# EAGLE design Speaker (EAGLE 7.7.0)
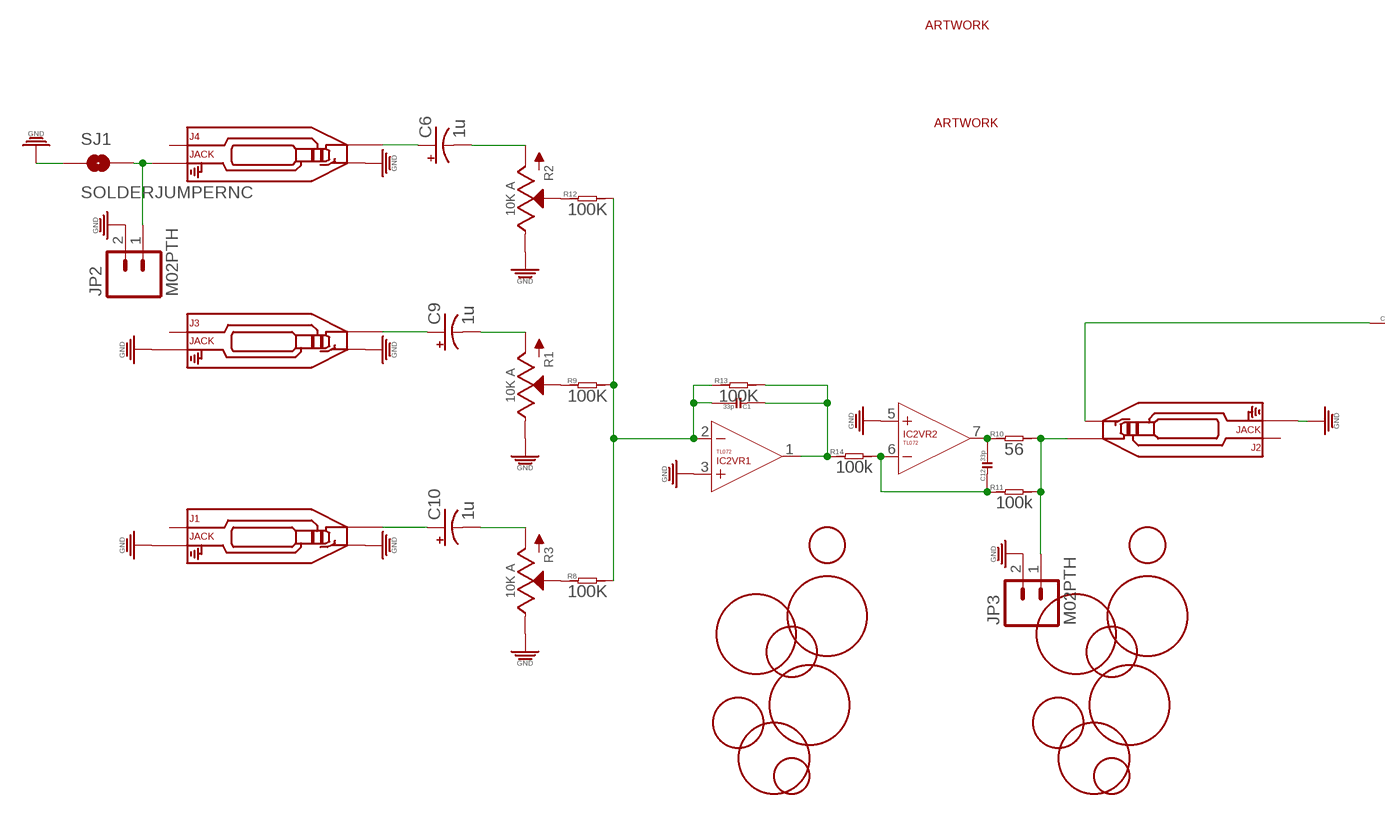
[diagram p0: schematic, sheet 1, part 1 of 2]
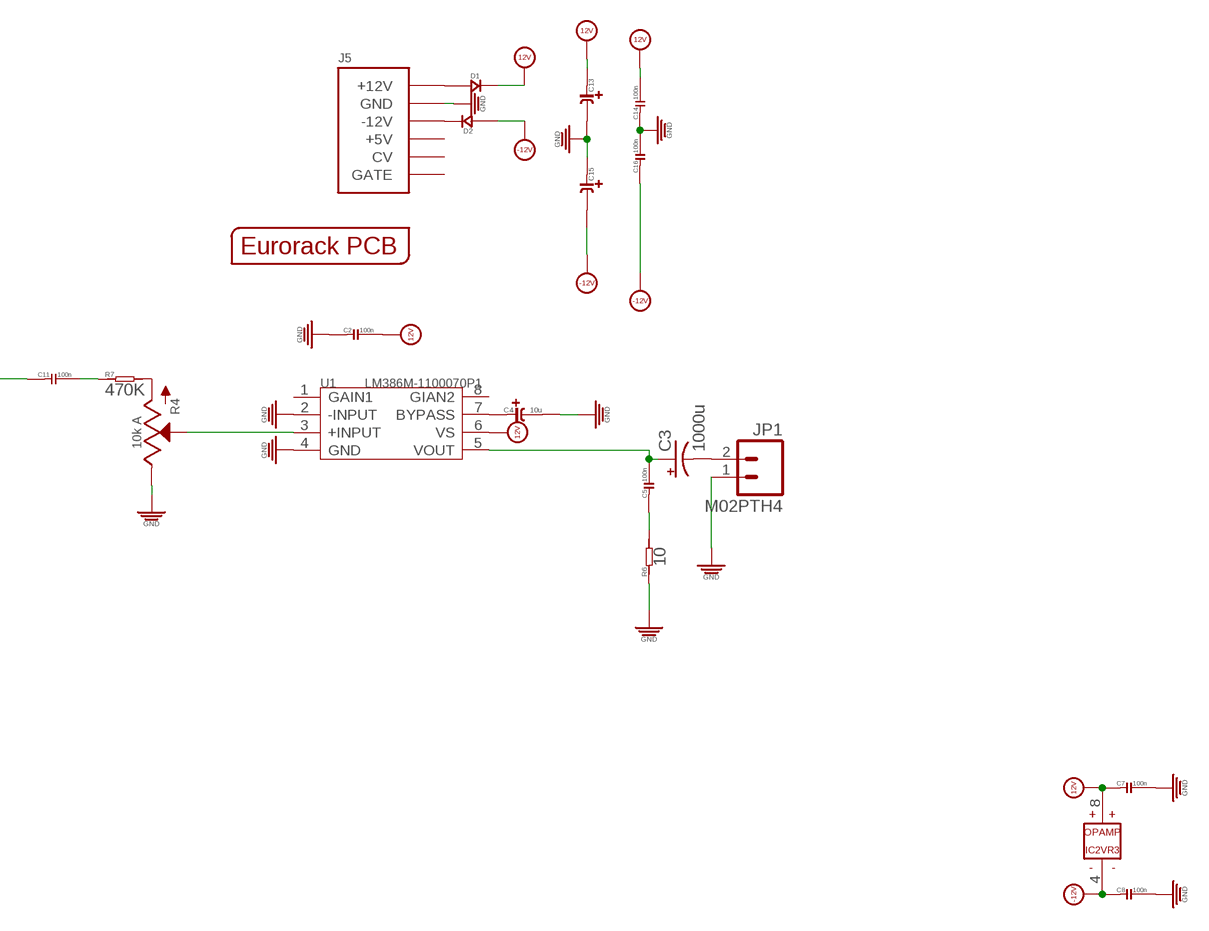
[diagram p1: schematic, sheet 1, part 2 of 2]

## Parts
C1  33p  C-0603  [C0603]
C2  100n  C-0603  [C0603]
C3  1000u  CPOL-US153CLV-1010  [153CLV-1010]
C4  10u  C-POLAR-A  [CASE-A_3216]
C5  100n  C-0603  [C0603]
C6  1u  CPOL-USD  [PANASONIC_D]
C7  100n  C-0603  [C0603]
C8  100n  C-0603  [C0603]
C9  1u  CPOL-USD  [PANASONIC_D]
C10  1u  CPOL-USD  [PANASONIC_D]
C11  100n  C-0603  [C0603]
C12  33p  C-0603  [C0603]
C13  C-POLAR-A  [CASE-A_3216]
C14  100n  C-0603  [C0603]
C15  C-POLAR-A  [CASE-A_3216]
C16  100n  C-0603  [C0603]
D1  D-SOD-123  [SOD123]
D2  D-SOD-123  [SOD123]
IC2  TL072  [SO08]
J1  JACK  AUDIO-JACK_SMALLSYMBOLNODRILL  [3.5MM-JACK-SWITCH-13MM-NOHOLES]
J2  JACK  AUDIO-JACK_SMALLSYMBOLNODRILL  [3.5MM-JACK-SWITCH-13MM-NOHOLES]
J3  JACK  AUDIO-JACK_SMALLSYMBOLNODRILL  [3.5MM-JACK-SWITCH-13MM-NOHOLES]
J4  JACK  AUDIO-JACK_SMALLSYMBOLNODRILL  [3.5MM-JACK-SWITCH-13MM-NOHOLES]
J5  POWERSHROUDED  [POWER_16_SHROUDED]
JP1  M02PTH4  [1X02_XTRA_BIG]
JP2  M02PTH  [1X02]
JP3  M02PTH  [1X02]
PCB1  EURORACK_PCB6HP  [EURORACK6HPPCB]
R1  10K A  POTSQUAREHOLE_SMALLKNOB  [ALPS_POT_SQUAREHOLES]
R2  10K A  POTSQUAREHOLE_SMALLKNOB  [ALPS_POT_SQUAREHOLES]
R3  10K A  POTSQUAREHOLE_SMALLKNOB  [ALPS_POT_SQUAREHOLES]
R4  10k A  POTSQUAREHOLE_SMALLKNOB  [ALPS_POT_SQUAREHOLES]
R6  10  R-0603  [R0603]
R7  470K  R-0603  [R0603]
R8  100K  R-0603  [R0603]
R9  100K  R-0603  [R0603]
R10  56  R-0603  [R0603]
R11  100k  R-0603  [R0603]
R12  100K  R-0603  [R0603]
R13  100K  R-0603  [R0603]
R14  100k  R-0603  [R0603]
SJ1  SOLDERJUMPERNC  [SJ_2S]
U1  LM386M-1100070P1  [SOIC8]
U$1  BUBBLESDSA_1U  [BUBBLES]
U$8  BUBBLESINV  [BUBBLES_INV]
U$13  TINRS_ARTWORKTINYDATE  [JUSTATINYROCKET_DATECODE]
U$14  TINRS_ARTWORKLOGO  [TINRSLOGO]

## Nets
12V [power]: C2.2 C7.1 C13.+ C14.2 D1.- IC2.8(VR3:V+) U1.6(VS)
-12V [power]: C8.1 C15.- C16.1 D2.+ IC2.4(VR3:V-)
GND [power]: C2.1 C4.- C7.2 C8.2 C13.- C14.1 C15.+ C16.2 IC2.3(VR1:+IN) IC2.5(VR2:+IN) J1.RING_B@1(RING) J1.RING_T@3(RING) J1.SWITCH_B@1(SWITCH) J1.SWITCH_T@3(SWITCH) J2.RING_B@1(RING) J2.RING_T@3(RING) J3.RING_B@1(RING) J3.RING_T@3(RING) J3.SWITCH_B@1(SWITCH) J3.SWITCH_T@3(SWITCH) J4.SWITCH_B@1(SWITCH) J4.SWITCH_T@3(SWITCH) J5.3(GND) J5.4(GND) J5.5(GND) J5.6(GND) J5.7(GND) J5.8(GND) JP1.1 JP2.2 JP3.2 R1.P$1(E) R2.P$1(E) R3.P$1(E) R4.P$1(E) R6.1 SJ1.1 U1.2(-INPUT) U1.4(GND)
N$1: C3.- JP1.2
N$2 [power]: C3.+ C5.2 U1.5(VOUT)
N$3: C5.1 R6.2
N$4: C4.+ U1.7(BYPASS)
N$5: R4.P$2(S) U1.3(+INPUT)
N$6: C1.2 IC2.2(VR1:-IN) R8.2 R9.2 R12.2 R13.1
N$7: C12.1 IC2.6(VR2:-IN) R11.1 R14.2
N$8: C6.+ J4.TIP_B@1(TIP) J4.TIP_T@3(TIP)
N$9: C11.2 R7.1
N$10: C9.+ J3.TIP_B@1(TIP) J3.TIP_T@3(TIP)
N$11: C10.+ J1.TIP_B@1(TIP) J1.TIP_T@3(TIP)
N$12: C11.1 J2.SWITCH_B@1(SWITCH) J2.SWITCH_T@3(SWITCH)
N$13: C12.2 IC2.7(VR2:OUT) R10.1
N$14: J2.TIP_B@1(TIP) J2.TIP_T@3(TIP) JP3.1 R10.2 R11.2
N$15: R4.P$3(A) R7.2
N$16: R1.P$2(S) R9.1
N$17: R2.P$2(S) R12.1
N$18: R3.P$2(S) R8.1
N$19: C1.1 IC2.1(VR1:OUT) R13.2 R14.1
N$20: C10.- R3.P$3(A)
N$21: C9.- R1.P$3(A)
N$22: C6.- R2.P$3(A)
N$23 [power]: D1.+ J5.9(+12V) J5.10(+12V)
N$24 [power]: D2.- J5.1(-12V) J5.2(-12V)
N$25 [power]: J4.RING_B@1(RING) J4.RING_T@3(RING) JP2.1 SJ1.2
Unconnected: J1.SECOND_B@1(SECOND) J1.SECOND_T@3(SECOND) J2.SECOND_B@1(SECOND) J2.SECOND_T@3(SECOND) J3.SECOND_B@1(SECOND) J3.SECOND_T@3(SECOND) J4.SECOND_B@1(SECOND) J4.SECOND_T@3(SECOND) J5.11(+5V) J5.12(+5V) J5.13(CV) J5.14(CV) J5.15(GATE) J5.16(GATE) U1.1(GAIN1) U1.8(GIAN2)

## Library data of the parts
C1 C2 C5 C7 C8 C11 C12 C14 C16 = OPL:C*
C3 C6 C9 C10 = adafruit:CPOL-US: POLARIZED CAPACITOR, American symbol
C4 C13 C15 = EurorackModularParts:C-POLAR*
D1 D2 = OPL:D*: DIODE
IC2 = EurorackModularParts:TL072
J1 = EurorackModularParts:AUDIO-JACK_SMALLSYMBOL: Switching Mono 3.5mm Audio Jack from Erthenvar.; DESC: C
J2 = EurorackModularParts:AUDIO-JACK_SMALLSYMBOL: Switching Mono 3.5mm Audio Jack from Erthenvar.; DESC: Mix Out
J3 = EurorackModularParts:AUDIO-JACK_SMALLSYMBOL: Switching Mono 3.5mm Audio Jack from Erthenvar.; DESC: B
J4 = EurorackModularParts:AUDIO-JACK_SMALLSYMBOL: Switching Mono 3.5mm Audio Jack from Erthenvar.; DESC: A
J5 = EurorackModularParts:POWER
JP1-JP3 = SparkFun-Connectors:M02: Standard 2-pin 0.1" header. Use with - straight break away headers ( PRT-00116) - right angle break away headers (PRT-00553) - swiss pins (PRT-00743) - machine pins (PRT-00117) - female headers (PRT-00115) Molex polarized connector foot print use with: PRT-08233 with associated crimp pins and housings. 2.54_SCREWTERM for use with PRT-10571. 3.5mm Screw Terminal footprints for PRT-08084 5mm Screw Terminal footprints for use with PRT-08433
PCB1 = EurorackModularParts:EURORACK_PCB
R1 = EurorackModularParts:POT; DESC: B
R2 = EurorackModularParts:POT; DESC: A
R3 = EurorackModularParts:POT; DESC: C
R4 = EurorackModularParts:POT; DESC: Volume
R6-R14 = OPL:R*
SJ1 = SparkFun-Passives:SOLDERJUMPER: Solder Jumper Standard SMD solder jumper. Used to automate production. Two varients : Normally Open and Normally Closed are the same, but have different paste layers. NC will have a large amount of paste and should jumper during reflow.
U1 = OPL:LM386M: Low Voltage Audio Power Amplifier http://www.ti.com/lit/ds/symlink/lm386.pdf
U$1 U$8 = EurorackModularParts:BUBBLES
U$13 U$14 = EurorackModularParts:TINRS_ARTWORK

## Net classes
0 default: width 0.254 mm
1 power: width 0.381 mm

## Board
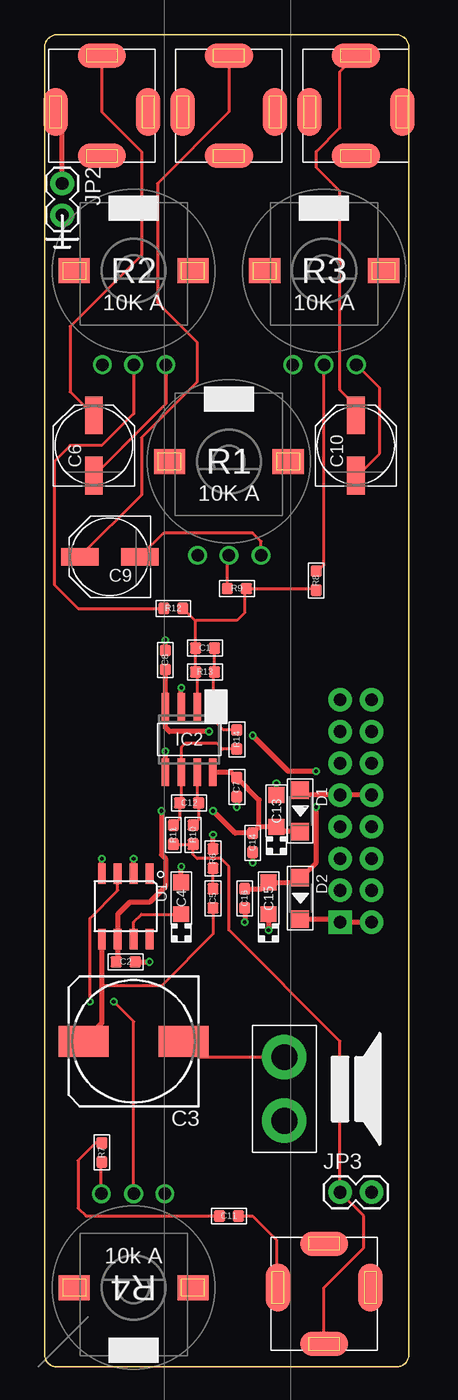
[diagram p2: board, top side]
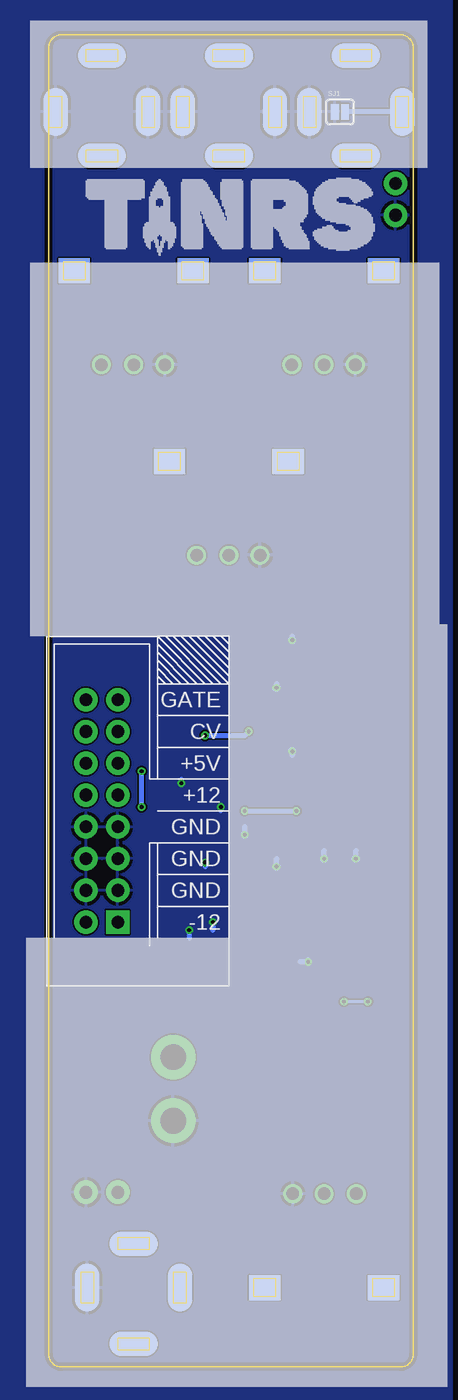
[diagram p3: board, bottom side, seen from below]

Size 29.14 x 106.5 mm. Coordinates in mm from the lower left corner, seen from the top.
Copper layers (1*16): Top 0.035mm / dielectric 1.5mm / Bottom 0.035mm
Design rules "dirt_cheap_dirty_boards.v1": minimum track width 5mil, minimum drill 12mil, track to track 5mil, track to pad 5mil, pad to pad 5mil, via to via 5mil, smd to smd 0mil, copper to edge 10mil, drill to drill 10mil, minimum pad ring 10mil, minimum via ring 6mil, stop-mask expansion 2mil, vias tented up to drill 25mil, thermal gap 10mil

### Footprints (pad centres in the part's own frame; a part is rotated, then mirrored left to right if it is on the bottom)
C0603 = smd 0.889 x 0.889: 1 -0.762,0; 2 0.762,0
153CLV-1010 = smd 4 x 2.5: + 4,0; - -4,0
CASE-A_3216 = smd 1.27 x 1.27: + -1.27,0; - 1.27,0
PANASONIC_D = smd 3 x 1.4: + 2.4,0; - -2.4,0
SOD123 = smd 1.397 x 1.397: + -1.651,0; - 1.651,0
SO08 = smd 0.6 x 2.2: 1 -1.905,-2.6; 2 -0.635,-2.6; 3 0.635,-2.6; 4 1.905,-2.6; 5 1.905,2.6; 6 0.635,2.6; 7 -0.635,2.6; 8 -1.905,2.6
3.5MM-JACK-SWITCH-13MM-NOHOLES = smd 1.95 x 3.85 bottom: RING_B@1 -3.7,0; SWITCH_B@1 3.7,0 | smd 1.95 x 3.85: RING_T@3 -3.7,0; SWITCH_T@3 3.7,0 | smd 3.85 x 1.95 bottom: SECOND_B@1 0,-3.5; TIP_B@1 0,4.5 | smd 3.85 x 1.95: SECOND_T@3 0,-3.5; TIP_T@3 0,4.5
POWER_16_SHROUDED = drill 1.016 pad 1.88 square: 1 -8.89,-1.27 | drill 1.016 pad 1.88: 2 -8.89,1.27; 3 -6.35,-1.27; 4 -6.35,1.27; 5 -3.81,-1.27; 6 -3.81,1.27; 7 -1.27,-1.27; 8 -1.27,1.27; 9 1.27,-1.27; 10 1.27,1.27; 11 3.81,-1.27; 12 3.81,1.27; 13 6.35,-1.27; 14 6.35,1.27; 15 8.89,-1.27; 16 8.89,1.27
1X02_XTRA_BIG = drill 2.057 pad 3.556: 1 -2.54,0; 2 2.54,0
1X02 = drill 1.016 pad 1.88: 1 0,0; 2 2.54,0
ALPS_POT_SQUAREHOLES = drill 1: P$1 -2.5,-7.5; P$2 0,-7.5; P$3 2.58,-7.5 | smd 2.5 x 2: P$4 -4.75,0; P$5 4.75,0 | smd 2.5 x 2 bottom: P$6 -4.75,0; P$7 4.75,0
R0603 = smd 0.889 x 0.889: 1 -0.762,0; 2 0.762,0
SJ_2S = smd 0.635 x 1.27: 1 -0.412,0; 2 0.412,0
SOIC8 = smd 1.651 x 0.635: 1 -2.616,1.905; 2 -2.616,0.635; 3 -2.616,-0.635; 4 -2.616,-1.905; 5 2.616,-1.905; 6 2.616,-0.635; 7 2.616,0.635; 8 2.616,1.905

### Placement (x,y rotation side)
C1  12.84,57.47 180 top
C2  6.48,32.38 180 top
C3  7.12,26.04 180 top
C4  10.93,37.46 90 top
C5  13.47,37.46 270 top
C6  3.95,73.66 90 top
C7  15.38,46.35 270 top
C8  9.66,56.51 90 top
C9  5.21,64.77 180 top
C10  24.9,73.66 90 top
C11  14.74,12.07 180 top
C12  11.57,45.08 0 top
C13  18.55,44.45 90 top
C14  16.64,41.91 90 top
C15  17.91,37.46 90 top
C16  16.01,37.46 270 top
D1  20.45,44.45 270 top
D2  20.45,37.46 270 top
IC2  11.57,50.16 180 top
J1  24.9,100.33 0 top
J2  22.36,6.35 180 top
J3  14.74,100.33 0 top
J4  4.58,100.33 0 top
J5  24.9,44.45 90 bottom
JP1  19.18,22.23 90 top
JP2  1.41,94.62 270 top
JP3  23.63,13.97 0 top
PCB1  -0.5,0 0 top
R1  14.74,72.39 0 top
R2  7.12,87.63 0 top
R3  22.36,87.63 0 top
R4  7.12,6.35 180 top
R6  13.47,40.64 270 top
R7  4.58,17.14 270 top
R8  21.73,62.87 270 top
R9  15.38,62.23 0 top
R10  11.88,42.54 270 top
R11  10.3,42.54 270 top
R12  10.3,60.64 0 top
R13  12.84,55.56 0 top
R14  15.38,50.16 270 top
SJ1  5.85,100.33 0 bottom
U1  6.48,36.83 270 top
U$1  14.74,52.07 0 top
U$8  14.74,36.83 0 top
U$13  2.04,58.1 0 bottom
U$14  14.74,92.08 0 bottom

### Tracks (layer width: path | path; a pad name or v marks a point on that pad's centre or on a via)
12V  (via drill 0.3)
  Top 0.381: D1.- 18.93,42.8 C13.+ 17.15,43.18 | 17.15,43.18 C14.2 15.25,42.67 v13.47,44.45 | C2.2 5.85,32.51 U1.6 5.85,36.2 6.8,37.15 8.39,37.15 9.66,38.42 9.66,40.64 9.34,40.96 v9.34,44.45 | IC2.8 14.93,47.56 C7.1 17.15,45.34 17.15,43.18
  Bottom 0.381: v13.47,44.45 v9.34,44.45
-12V  (via drill 0.3)
  Top 0.381: C16.1 17.41,38.23 C15.- 20.07,38.73 D2.+ 20.52,39.12 21.73,40.32 v21.73,44.77 | C8.1 IC2.4 9.66,51.12 9.98,50.8 v13.15,50.8 | v21.73,47.62 19.5,47.62 v16.64,50.48
  Bottom 0.381: v21.73,44.77 v21.73,47.62 | v16.64,50.48 13.47,50.48 v13.15,50.8
GND  (via drill 0.3)
  Top 0.381: C16.2 v16.01,35.56 | C15.+ v17.91,34.92 | U1.4 v4.58,40.64 | U1.2 v7.12,40.64 | C2.1 v8.39,32.38 | C4.- v10.93,40 | R6.1 v13.47,42.54 | C14.1 v16.64,40.32 | C8.2 v9.66,58.1 | IC2.3 v10.93,54.29 | C7.2 v15.38,44.77 | C13.- v18.55,46.67 | IC2.5 v9.66,49.21
  Bottom 0.381: v16.01,35.56 16.01,34.92 | v17.91,34.92 17.91,34.29 | v4.58,40.64 4.58,41.27 | v7.12,40.64 7.12,41.27 | v8.39,32.38 9.02,32.38 | v10.93,40 10.93,40.64 | v13.47,42.54 13.47,43.18 | v16.64,40.32 16.64,40 | v9.66,58.1 9.66,58.42 | v10.93,54.29 10.93,54.61 | v15.38,44.77 15.38,44.45 | v18.55,46.67 18.55,46.99 | v9.66,49.21 9.66,48.89
  pour Bottom: -3.04,123.19 -3.04,-15.88 33.79,-15.88 33.79,123.19
N$1
  Top 0.254: JP1.2 12.39,24.77 C3.-
N$2
  Top 0.254: C3.+ 3.12,26.48 | C5.2 13.47,34.61 9.34,30.48 4.58,30.48
  Top 0.381: U1.5 4.58,30.48 4.58,27.5 C3.+
N$3
  Top 0.254: C5.1 R6.2
N$4
  Top 0.254: U1.7 7.12,35.56 7.76,36.2 C4.+
N$5  (via drill 0.3)
  Top 0.254: R4.P$2 7.12,27.62 v5.53,29.21 | v3.63,29.21 3.63,35.88 5.85,38.1 U1.3
  Bottom 0.254: v5.53,29.21 v3.63,29.21
N$6
  Top 0.254: R8.2 21.6,62.23 R9.2 16.01,62.1 16.01,60.32 15.38,59.69 12.14,59.69 12.07,59.63 | IC2.2 12.2,55.44 R13.1 C1.2 12.07,59.63 | 12.07,59.63 R12.2
N$7
  Top 0.254: R11.1 10.8,43.81 C12.1 10.93,45.21 IC2.6 10.93,49.53 11.25,49.85 13.79,49.85 14.23,49.4 R14.2
N$8
  Top 0.254: J4.TIP_B@1 4.58,100.33 7.76,97.16 7.76,88.9 2.04,83.19 2.04,77.97 C6.+
N$9
  Top 0.254: R7.1 4.07,17.91 2.67,16.51 2.67,12.7 3.31,12.07 C11.2
N$10
  Top 0.254: J3.TIP_B@1 14.74,100.33 9.02,94.62 9.02,85.09 12.2,81.92 12.2,78.74 7.76,74.3 7.76,69.71 C9.+
N$11
  Top 0.254: C10.+ 24.9,76.84 23.63,78.11 23.63,93.98 21.73,95.89 21.73,97.16 23.63,99.06 23.63,103.56 J1.TIP_B@1
N$12
  Top 0.254: C11.1 16.64,12.07 18.55,10.16 18.55,6.46 J2.SWITCH_B@1
N$13
  Top 0.254: IC2.7 12.2,45.21 C12.2 12.33,43.75 R10.1
N$14
  Top 0.254: J2.TIP_B@1 22.36,6.35 25.54,9.53 25.54,12.07 JP3.1 23.63,26.04 14.74,34.92 14.74,40 14.11,40.64 12.2,40.64 11.88,40.96 R10.2 R11.2
N$15
  Top 0.254: R4.P$3 4.54,16.34 R7.2
N$16
  Top 0.254: R9.1 14.61,64.76 R1.P$2
N$17
  Top 0.254: R2.P$2 7.12,76.2 4.58,73.66 2.04,73.66 0.77,72.39 0.77,62.55 2.67,60.64 R12.1
N$18
  Top 0.254: R8.1 21.85,63.63 22.36,64.14 R3.P$2
N$19
  Top 0.254: C1.1 R13.2 13.47,55.44 IC2.1 13.47,51.75 14.3,50.93 R14.1
N$20
  Top 0.254: C10.- 25.04,71.26 26.8,73.03 26.8,78.27 R3.P$3
N$21
  Top 0.254: R1.P$3 17.32,66 16.64,66.67 9.52,66.67 C9.-
N$22
  Top 0.254: R2.P$3 9.7,77.02 C6.-
N$23
  Top 0.381: J5.10 J5.9 20.84,45.72 D1.+
N$24
  Top 0.381: D2.- 23.38,35.81 J5.1 J5.2
N$25
  Top 0.381: JP2.1 1.41,99.81 arc90 J4.RING_T@3
  Bottom 0.381: J4.RING_T@3 SJ1.2